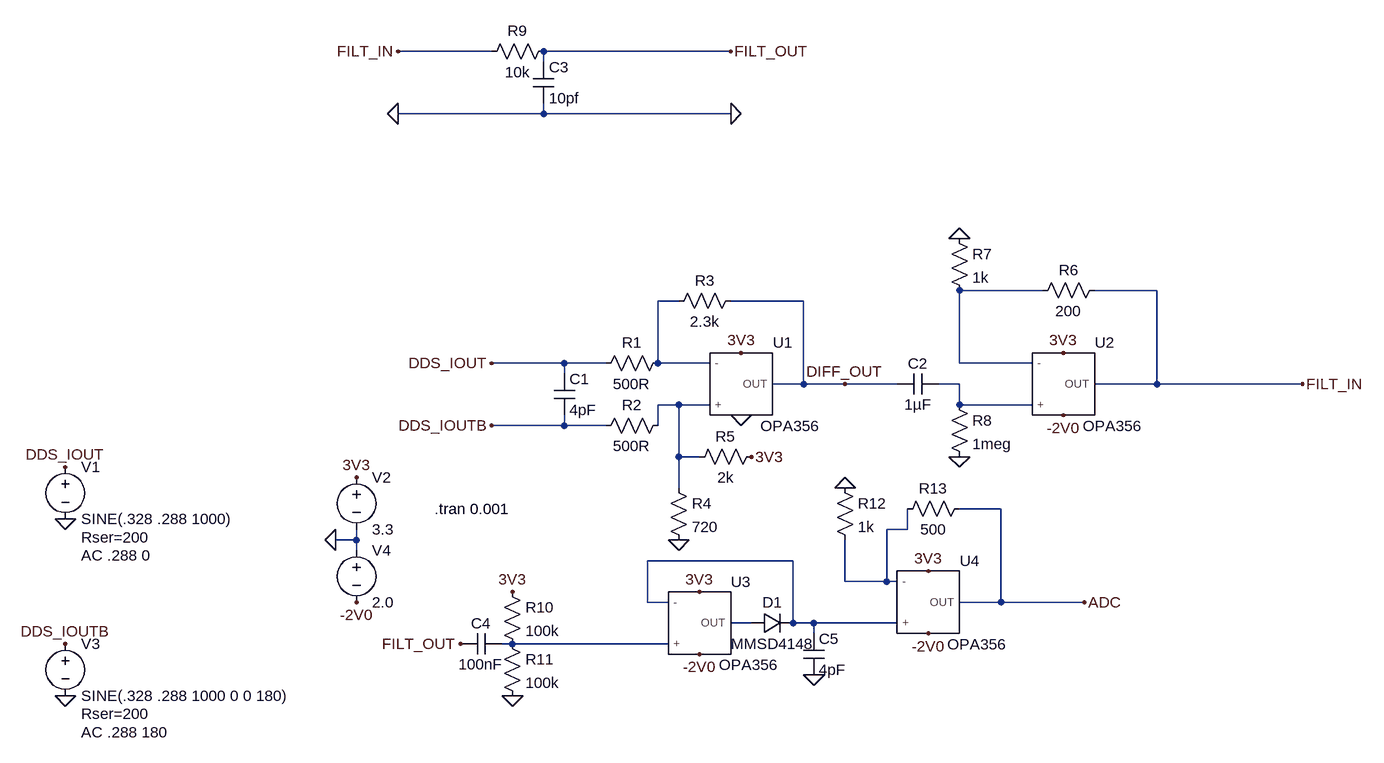
[diagram p0: schematic Differential test.asc]
Differential test.asc, the LTspice schematic file:
Version 4
SHEET 1 1284 840
WIRE -80 -224 -224 -224
WIRE 288 -224 0 -224
WIRE 0 -208 0 -224
WIRE 0 -128 0 -144
WIRE 0 -128 -224 -128
WIRE 288 -128 0 -128
WIRE 768 144 640 144
WIRE 944 144 848 144
WIRE 208 160 176 160
WIRE 400 160 288 160
WIRE 32 256 -80 256
WIRE 96 256 32 256
WIRE 176 256 176 160
WIRE 256 256 176 256
WIRE 640 256 640 144
WIRE 752 256 640 256
WIRE 32 272 32 256
WIRE 400 288 400 160
WIRE 400 288 352 288
WIRE 464 288 400 288
WIRE 544 288 464 288
WIRE 640 288 608 288
WIRE 944 288 944 144
WIRE 944 288 848 288
WIRE 1168 288 944 288
WIRE 208 320 176 320
WIRE 256 320 208 320
WIRE 640 320 640 288
WIRE 752 320 640 320
WIRE 32 352 32 336
WIRE 32 352 -80 352
WIRE 96 352 32 352
WIRE 176 352 176 320
WIRE 208 400 208 320
WIRE 240 400 208 400
WIRE 208 448 208 400
WIRE 704 480 640 480
WIRE 560 512 560 480
WIRE 560 512 528 512
WIRE -288 528 -288 512
WIRE -288 528 -320 528
WIRE -288 544 -288 528
WIRE 384 560 160 560
WIRE 464 592 464 528
WIRE 528 592 528 512
WIRE 528 592 464 592
WIRE 544 592 528 592
WIRE 160 624 160 560
WIRE 192 624 160 624
WIRE 704 624 704 480
WIRE 704 624 640 624
WIRE 832 624 704 624
WIRE 320 656 288 656
WIRE 384 656 384 560
WIRE 416 656 384 656
WIRE 544 656 416 656
WIRE 416 672 416 656
WIRE -48 688 -64 688
WIRE 192 688 -48 688
FLAG 304 336 0
FLAG -288 432 3V3
FLAG 304 240 3V3
FLAG -736 496 0
FLAG -736 768 0
FLAG -736 416 DDS_IOUT
FLAG -736 688 DDS_IOUTB
FLAG -80 256 DDS_IOUT
FLAG -80 352 DDS_IOUTB
FLAG 320 400 3V3
FLAG 208 528 0
FLAG -288 624 -2V0
FLAG -320 528 0
FLAG 1168 288 FILT_IN
FLAG 640 64 0
FLAG 800 240 3V3
FLAG 800 336 -2V0
FLAG 464 288 DIFF_OUT
FLAG 640 400 0
FLAG -128 688 FILT_OUT
FLAG -224 -224 FILT_IN
FLAG 288 -224 FILT_OUT
FLAG -224 -128 0
FLAG 288 -128 0
FLAG -48 608 3V3
FLAG -48 768 0
FLAG 240 608 3V3
FLAG 240 704 -2V0
FLAG 832 624 ADC
FLAG 592 576 3V3
FLAG 416 736 0
FLAG 464 448 0
FLAG 592 672 -2V0
SYMBOL voltage -288 416 R0
WINDOW 123 0 0 Left 2
WINDOW 39 0 0 Left 2
SYMATTR InstName V2
SYMATTR Value 3.3
SYMBOL AutoGenerated\\OPA356 304 288 R0
SYMATTR InstName U1
SYMBOL voltage -736 400 R0
WINDOW 123 24 152 Left 2
WINDOW 39 24 124 Left 2
SYMATTR Value2 AC .288 0
SYMATTR SpiceLine Rser=200
SYMATTR InstName V1
SYMATTR Value SINE(.328 .288 1000)
SYMBOL voltage -736 672 R0
WINDOW 123 24 152 Left 2
WINDOW 39 24 124 Left 2
SYMATTR Value2 AC .288 180
SYMATTR SpiceLine Rser=200
SYMATTR InstName V3
SYMATTR Value SINE(.328 .288 1000 0 0 180)
SYMBOL cap 16 272 R0
SYMATTR InstName C1
SYMATTR Value 4pF
SYMBOL res 80 272 R270
WINDOW 0 32 56 VTop 2
WINDOW 3 0 56 VBottom 2
SYMATTR InstName R1
SYMATTR Value 500R
SYMBOL res 80 368 R270
WINDOW 0 32 56 VTop 2
WINDOW 3 0 56 VBottom 2
SYMATTR InstName R2
SYMATTR Value 500R
SYMBOL res 192 176 R270
WINDOW 0 32 56 VTop 2
WINDOW 3 0 56 VBottom 2
SYMATTR InstName R3
SYMATTR Value 2.3k
SYMBOL res 192 432 R0
SYMATTR InstName R4
SYMATTR Value 720
SYMBOL res 224 416 R270
WINDOW 0 32 56 VTop 2
WINDOW 3 0 56 VBottom 2
SYMATTR InstName R5
SYMATTR Value 2k
SYMBOL voltage -288 528 R0
WINDOW 123 0 0 Left 2
WINDOW 39 0 0 Left 2
SYMATTR InstName V4
SYMATTR Value 2.0
SYMBOL AutoGenerated\\OPA356 800 288 R0
SYMATTR InstName U2
SYMBOL res 752 160 R270
WINDOW 0 32 56 VTop 2
WINDOW 3 0 56 VBottom 2
SYMATTR InstName R6
SYMATTR Value 200
SYMBOL res 624 48 R0
SYMATTR InstName R7
SYMATTR Value 1k
SYMBOL cap 544 304 R270
WINDOW 0 32 32 VTop 2
WINDOW 3 0 32 VBottom 2
SYMATTR InstName C2
SYMATTR Value 1µF
SYMBOL res 624 304 R0
SYMATTR InstName R8
SYMATTR Value 1meg
SYMBOL res -96 -208 R270
WINDOW 0 32 56 VTop 2
WINDOW 3 0 56 VBottom 2
SYMATTR InstName R9
SYMATTR Value 10k
SYMBOL cap -16 -208 R0
SYMATTR InstName C3
SYMATTR Value 10pf
SYMBOL res -64 592 R0
SYMATTR InstName R10
SYMATTR Value 100k
SYMBOL res -64 672 R0
SYMATTR InstName R11
SYMATTR Value 100k
SYMBOL cap -128 704 R270
WINDOW 0 32 32 VTop 2
WINDOW 3 0 32 VBottom 2
SYMATTR InstName C4
SYMATTR Value 100nF
SYMBOL AutoGenerated\\OPA356 240 656 R0
SYMATTR InstName U3
SYMBOL diode 320 672 R270
WINDOW 0 32 32 VTop 2
WINDOW 3 0 32 VBottom 2
SYMATTR InstName D1
SYMATTR Value MMSD4148
SYMBOL AutoGenerated\\OPA356 592 624 R0
SYMATTR InstName U4
SYMBOL cap 400 672 R0
SYMATTR InstName C5
SYMATTR Value 4pF
SYMBOL res 448 432 R0
SYMATTR InstName R12
SYMATTR Value 1k
SYMBOL res 544 496 R270
WINDOW 0 32 56 VTop 2
WINDOW 3 0 56 VBottom 2
SYMATTR InstName R13
SYMATTR Value 500
TEXT -168 480 Left 2 !.tran 0.001

The netlist it stands for:
* Differential test.asc
V2 3V3 0 3.3
XU1 DIFF_OUT 0 N004 N002 3V3 OPA356  ; pins OUT -V + - +V
V1 DDS_IOUT 0 SINE(.328 .288 1000) AC .288 0 Rser=200
V3 DDS_IOUTB 0 SINE(.328 .288 1000 0 0 180) AC .288 180 Rser=200
C1 DDS_IOUT DDS_IOUTB 4pF
R1 DDS_IOUT N002 500R
R2 DDS_IOUTB N004 500R
R3 N002 DIFF_OUT 2.3k
R4 N004 0 720
R5 N004 3V3 2k
V4 0 -2V0 2.0
XU2 FILT_IN -2V0 N003 N001 3V3 OPA356  ; pins OUT -V + - +V
R6 N001 FILT_IN 200
R7 0 N001 1k
C2 DIFF_OUT N003 1µF
R8 N003 0 1meg
R9 FILT_IN FILT_OUT 10k
C3 FILT_OUT 0 10pf
R10 3V3 N008 100k
R11 N008 0 100k
C4 FILT_OUT N008 100nF
XU3 N007 -2V0 N008 N006 3V3 OPA356  ; pins OUT -V + - +V
D1 N007 N006 MMSD4148
XU4 ADC -2V0 N006 N005 3V3 OPA356  ; pins OUT -V + - +V
C5 N006 0 4pF
R12 0 N005 1k
R13 N005 ADC 500
.model D D
.lib standard.dio
.tran 0.001
.lib OPA356.LIB
.backanno
.end